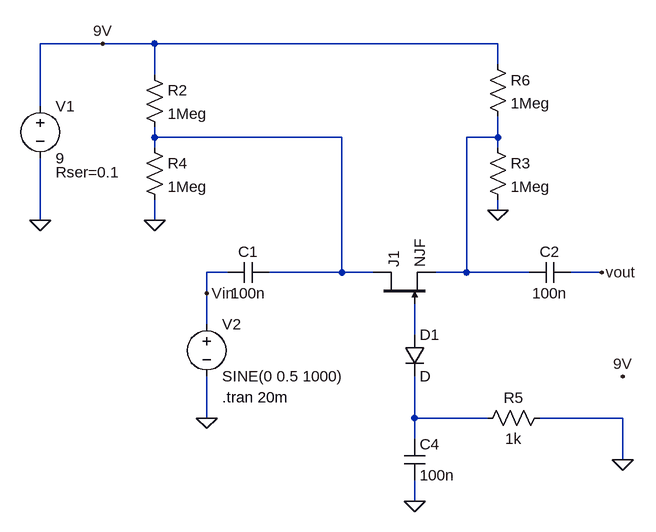
[diagram p0: schematic JFET_Circuit_Separate_Biases.asc]
JFET_Circuit_Separate_Biases.asc, the LTspice schematic file:
Version 4
SHEET 1 3112 2308
WIRE 48 -304 -48 -304
WIRE 128 -304 48 -304
WIRE 656 -304 128 -304
WIRE 656 -272 656 -304
WIRE 128 -256 128 -304
WIRE -48 -208 -48 -304
WIRE 128 -160 128 -176
WIRE 416 -160 128 -160
WIRE 656 -160 656 -192
WIRE 656 -160 608 -160
WIRE 128 -144 128 -160
WIRE 656 -144 656 -160
WIRE 656 -48 656 -64
WIRE -48 -32 -48 -128
WIRE 128 -32 128 -64
WIRE 240 48 208 48
WIRE 416 48 416 -160
WIRE 416 48 304 48
WIRE 464 48 416 48
WIRE 608 48 608 -160
WIRE 608 48 560 48
WIRE 704 48 608 48
WIRE 816 48 768 48
WIRE 208 80 208 48
WIRE 208 128 208 80
WIRE 528 144 528 96
WIRE 208 272 208 208
WIRE 528 272 528 208
WIRE 640 272 528 272
WIRE 848 272 720 272
WIRE 528 304 528 272
WIRE 848 336 848 272
WIRE 528 400 528 368
FLAG 208 272 0
FLAG -48 -32 0
FLAG 816 48 vout
FLAG 208 80 Vin
FLAG 128 -32 0
FLAG 656 -48 0
FLAG 528 400 0
FLAG 48 -304 9V
FLAG 848 208 9V
FLAG 848 336 0
SYMBOL voltage -48 -224 R0
WINDOW 123 0 0 Left 2
WINDOW 39 24 118 Left 2
SYMATTR SpiceLine Rser=0.1
SYMATTR InstName V1
SYMATTR Value 9
SYMBOL voltage 208 112 R0
WINDOW 123 24 124 Left 2
WINDOW 39 0 0 Left 2
SYMATTR InstName V2
SYMATTR Value SINE(0 0.5 1000)
SYMBOL cap 240 64 R270
WINDOW 0 32 32 VTop 2
WINDOW 3 0 32 VBottom 2
SYMATTR InstName C1
SYMATTR Value 100n
SYMBOL cap 704 64 R270
WINDOW 0 32 32 VTop 2
WINDOW 3 0 32 VBottom 2
SYMATTR InstName C2
SYMATTR Value 100n
SYMBOL res 640 -160 R0
WINDOW 0 36 40 Left 2
WINDOW 3 36 76 Left 2
SYMATTR InstName R3
SYMATTR Value 1Meg
SYMBOL res 112 -272 R0
WINDOW 0 36 40 Left 2
WINDOW 3 36 76 Left 2
SYMATTR InstName R2
SYMATTR Value 1Meg
SYMBOL res 112 -160 R0
WINDOW 0 36 40 Left 2
WINDOW 3 36 76 Left 2
SYMATTR InstName R4
SYMATTR Value 1Meg
SYMBOL njf 464 96 R270
SYMATTR InstName J1
SYMBOL diode 512 144 R0
SYMATTR InstName D1
SYMBOL cap 512 304 R0
SYMATTR InstName C4
SYMATTR Value 100n
SYMBOL res 736 256 R90
WINDOW 0 0 56 VBottom 2
WINDOW 3 32 56 VTop 2
SYMATTR InstName R5
SYMATTR Value 1k
SYMBOL res 640 -288 R0
WINDOW 0 36 40 Left 2
WINDOW 3 36 76 Left 2
SYMATTR InstName R6
SYMATTR Value 1Meg
TEXT 232 240 Left 2 !.tran 20m

The netlist it stands for:
* JFET_Circuit_Separate_Biases.asc
V1 9V 0 9 Rser=0.1
V2 Vin 0 SINE(0 0.5 1000)
C1 Vin N001 100n
C2 N002 vout 100n
R3 N002 0 1Meg
R2 9V N001 1Meg
R4 N001 0 1Meg
J1 N001 N003 N002 NJF
D1 N003 N004 D
C4 N004 0 100n
R5 0 N004 1k
R6 9V N002 1Meg
.model D D
.lib standard.dio
.model NJF NJF
.model PJF PJF
.lib standard.jft
.tran 20m
.backanno
.end